# Altium schematic sheet ISO_SPI.SchDoc
size A4; SheetNumber: 2; SheetTotal: 4
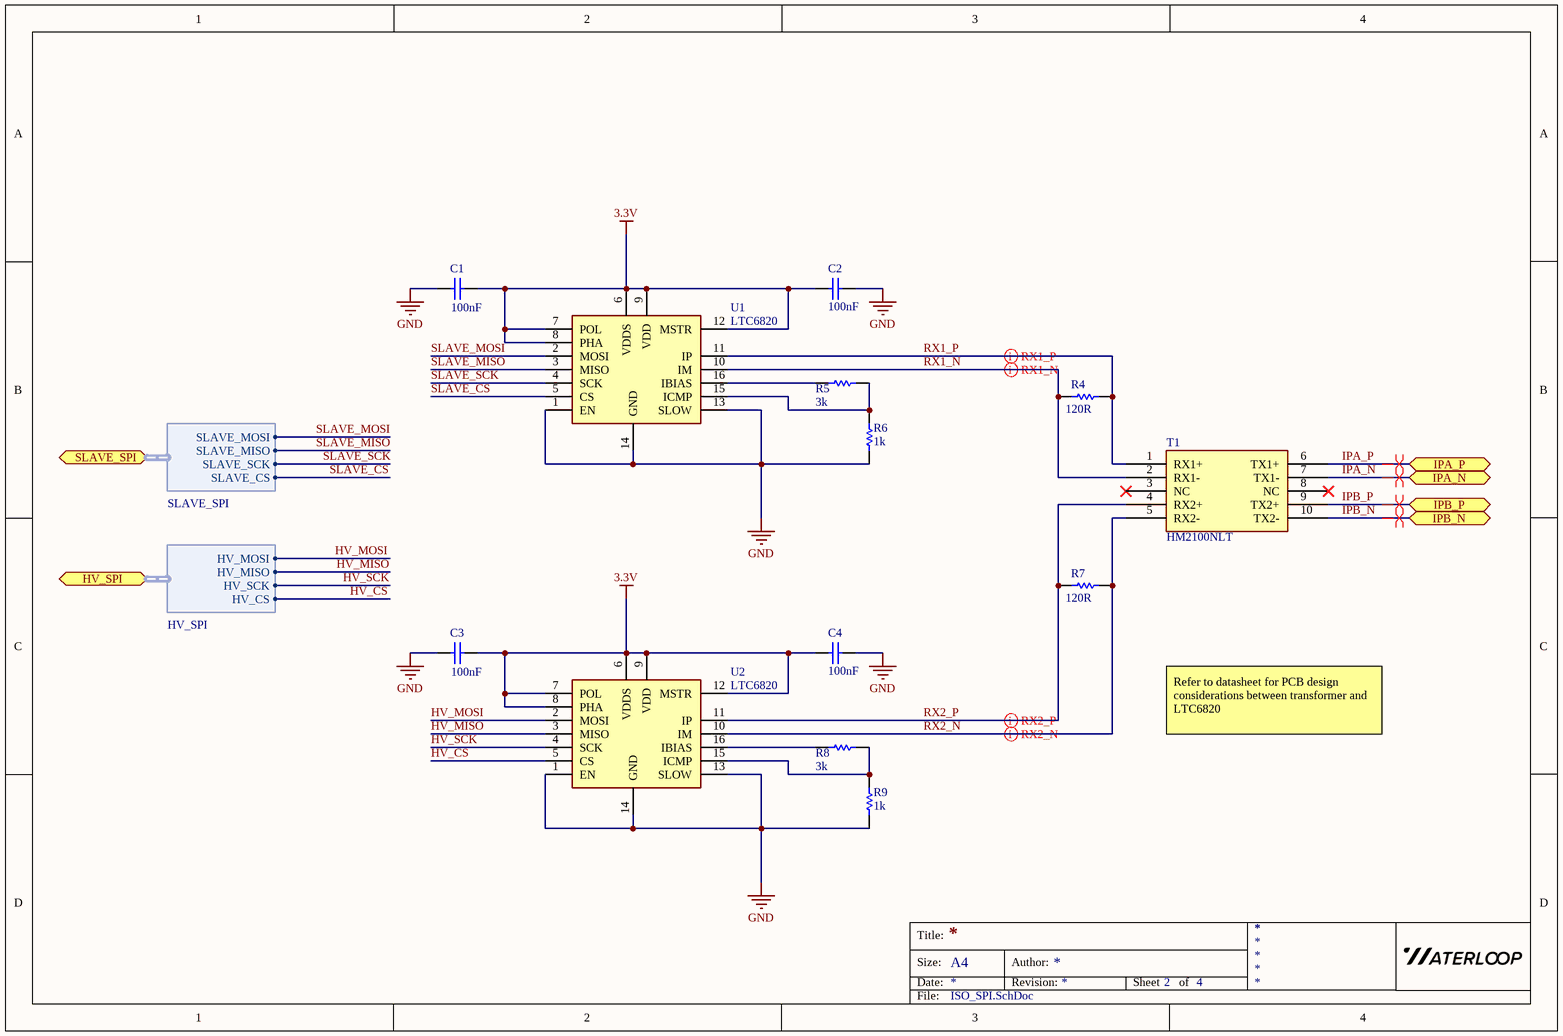
[diagram p0: ISO_SPI.SchDoc]

## Parts
C1  value 100nF  [0805 - Capacitor]  (hidden comment: 10V)
C2  value 100nF  [0805 - Capacitor]  (hidden comment: 10V)
C3  value 100nF  [0805 - Capacitor]  (hidden comment: 10V)
C4  value 100nF  [0805 - Capacitor]  (hidden comment: 10V)
R4  value 120R  [0603 - Resistor]  (hidden comment: 1%)
R5  value 3k  [0603 - Resistor]  (hidden comment: 1%)
R6  value 1k  [0603 - Resistor]  (hidden comment: 1%)
R7  value 120R  [0603 - Resistor]  (hidden comment: 1%)
R8  value 3k  [0603 - Resistor]  (hidden comment: 1%)
R9  value 1k  [0603 - Resistor]  (hidden comment: 1%)
T1  HM2100NLT  [HM2100NLT]
U1  LTC6820  [LT6820_QFN]
U2  LTC6820  [LT6820_QFN]

## Ports
HV_SPI (bidir, harness HV_SPI), IPA_N (bidir), IPA_P (bidir), IPB_N (bidir), IPB_P (bidir), SLAVE_SPI (bidir, harness SLAVE_SPI)

## Harnesses
SLAVE_SPI: SLAVE_MOSI, SLAVE_MISO, SLAVE_SCK, SLAVE_CS
HV_SPI: HV_MOSI, HV_MISO, HV_SCK, HV_CS

## Nets
3.3V: C1.2 C2.1 C3.2 C4.1 U1.6(VDDS) U1.7(POL) U1.8(PHA) U1.9(VDD) U1.12(MSTR) U2.6(VDDS) U2.7(POL) U2.8(PHA) U2.9(VDD) U2.12(MSTR)
GND: C1.1 C2.2 C3.1 C4.2 R6.1 R9.1 U1.1(EN) U1.13(SLOW) U1.14(GND) U2.1(EN) U2.13(SLOW) U2.14(GND)
HV_CS: U2.5(CS) ; port HV_SPI.HV_CS
HV_MISO: U2.3(MISO) ; port HV_SPI.HV_MISO
HV_MOSI: U2.2(MOSI) ; port HV_SPI.HV_MOSI
HV_SCK: U2.4(SCK) ; port HV_SPI.HV_SCK
IPA_N: T1.7(TX1-) ; port IPA_N
IPA_P: T1.6(TX1+) ; port IPA_P
IPB_N: T1.10(TX2-) ; port IPB_N
IPB_P: T1.9(TX2+) ; port IPB_P
RX1_N: R4.1 T1.2(RX1-) U1.10(IM)
RX1_P: R4.2 T1.1(RX1+) U1.11(IP)
RX2_N: R7.2 T1.5(RX2-) U2.10(IM)
RX2_P: R7.1 T1.4(RX2+) U2.11(IP)
SLAVE_CS: U1.5(CS) ; port SLAVE_SPI.SLAVE_CS
SLAVE_MISO: U1.3(MISO) ; port SLAVE_SPI.SLAVE_MISO
SLAVE_MOSI: U1.2(MOSI) ; port SLAVE_SPI.SLAVE_MOSI
SLAVE_SCK: U1.4(SCK) ; port SLAVE_SPI.SLAVE_SCK
NetR5_1: R5.1 U1.16(IBIAS)
NetR5_2: R5.2 R6.2 U1.15(ICMP)
NetR8_1: R8.1 U2.16(IBIAS)
NetR8_2: R8.2 R9.2 U2.15(ICMP)

Not connected (* = marked no-connect by the designer): T1 3(NC)* 8(NC)*

## Layout directives
differential pair: IPA_N, IPA_P, IPB_N, IPB_P, RX1_N, RX1_P, RX2_N, RX2_P

## Notes on the sheet
- Refer to datasheet for PCB design considerations between transformer and LTC6820
- Title:
- Size:
- Date:
- A4
- Author:
- Revision:
- Sheet
- of
- File:

## Library data of the parts
C1-C4 = Capacitor - Nonpolarized: C0805C103K8RAC7800. 10000pF ±10% 10V Ceramic Capacitor X7R 0805 (2012 Metric); Manufacturer: YAGEO; Manufacturer Part Number: CC0805MRX7R9BB103; Rating: 50V; Supplier Part Number: 311-4350-1-ND; Supplier: Digi-Key
R4 R7 = Resistor: RC0603FR-07120RL. 120 Ohms ±1% 0.1W, 1/10W Chip Resistor 0603 (1608 Metric) Moisture Resistant Thick Film; Manufacturer Part Number: RC0603FR-10120RL; Manufacturer: YAGEO; Rating: 0.1W; Supplier Part Number: 13-RC0603FR-10120RLCT-ND; Supplier: Digi-Key
R5 R8 = Resistor: RMCF0603FT3K00. 3 kOhms ±1% 0.1W, 1/10W Chip Resistor 0603 (1608 Metric) Automotive AEC-Q200 Thick Film; Manufacturer Part Number: RC0603FR-073KL; Manufacturer: YAGEO; Rating: 0.1W; Supplier Part Number: 311-3.00KHRCT-ND; Supplier: Digi-Key
R6 R9 = Resistor: RC0603FR-071KL .1 kOhms ±1% 0.1W, 1/10W Chip Resistor 0603 (1608 Metric) Moisture Resistant Thick Film; Manufacturer Part Number: RC0603JR-071KL; Manufacturer: YAGEO; Rating: 0.1W; Supplier Part Number: 311-1.0KGRCT-ND; Supplier: Digi-Key
T1 = HM2100NLT: Pulse Transformer 1:1 Surface Mount 150µH, 450µH; Manufacturer: Pulse Electronics; Datasheet: https://productfinder.pulseeng.com/doc_type/WEB301/doc_num/HM2100NL/doc_part/HM2100NL.pdf; Supplier Part Number: 1840-1032-1-ND; Supplier: Digikey; Manufacturer Part Number: HM2100NLT
U1 U2 = LTC6820: Manufacturer: Analog Devices; Manufacturer Part Number: LTC6820IMS#TRPBF; Supplier: Digikey; Supplier Part Number: LTC6820IMS#TRPBFCT-ND